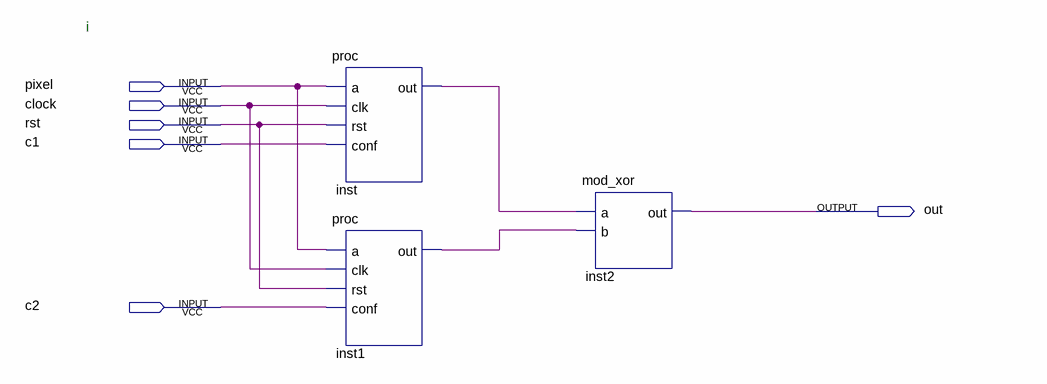
[diagram p0: schematic sheet]
// Quartus schematic sub.bdf as structural Verilog: 3 symbols, 6 pins
module sub (
  input  pixel,
  input  clock,
  input  rst,
  input  c1,
  input  c2,
  output out
);

  wire inst1_out, inst_out;

  proc inst (.a(pixel), .clk(clock), .rst(rst), .conf(c1), .out(inst_out));
  proc inst1 (.a(pixel), .clk(clock), .rst(rst), .conf(c2), .out(inst1_out));
  mod_xor inst2 (.a(inst_out), .b(inst1_out), .out(out));

  // Notes on the sheet:
  //   i
endmodule
